# Altium schematic sheet SidePanel.SchDoc
size A4; Organization: Altium Limited; Address1: L3, 12a Rodborough Rd; Address2: Frenchs Forest; Address3: NSW; Address4: Australia 2086
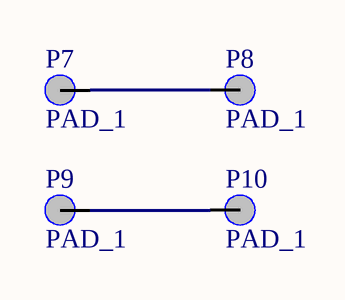
[diagram p0: SidePanel.SchDoc]

## Parts
P7  PAD_1  [Pad_Pin_1]
P8  PAD_1  [Pad_Pin_1]
P9  PAD_1  [Pad_Pin_1]
P10  PAD_1  [Pad_Pin_1]

## Nets
NetP7_1: P7.1 P8.1
NetP9_1: P9.1 P10.1

## Notes on the sheet
- Title
- Size:
- Date:
- A4
- Number:
- Time:
- Revision:
- Sheet
- of
- File:

## Library data of the parts
P7-P10 = PAD_1: 1脚焊盘